# Altium project activity_tracker.PrjPCB
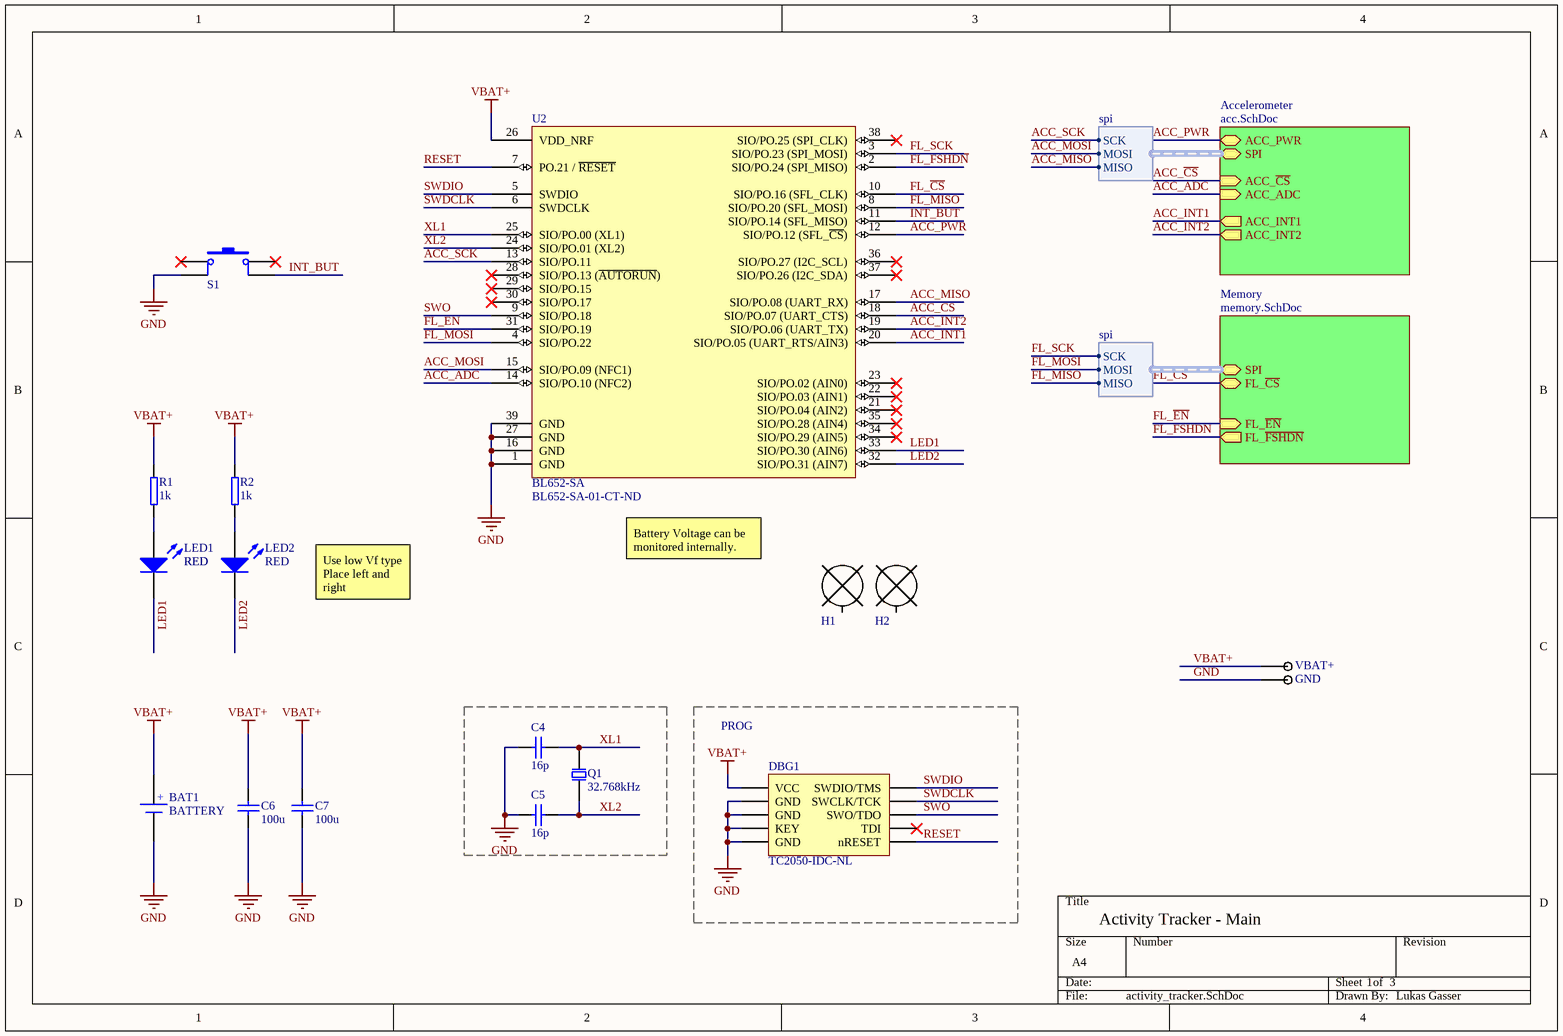
[diagram p0: activity_tracker.SchDoc]
ProjectRevision: 0.2.0
3 sheets, 28 parts. Net scope: hierarchical (ports join the sheet entries above them; power ports are global).
Board files: activity_tracker.PcbDoc, activity_tracker_panel.PcbDoc, activity_tracker_panel_support.PcbDoc
Sheets:
  activity_tracker.SchDoc
    Accelerometer = acc.SchDoc
    Memory = memory.SchDoc

## Sheet activity_tracker.SchDoc: Activity Tracker - Main
size A4; DrawnBy: Lukas Gasser; DocumentNumber: 1; Revision: 0.2.0; SheetNumber: 1; SheetTotal: 3

### Parts
BAT1  BATTERY  [BK-912_MIN_FP]
C4  16p  [CAPC1608X95N]
C5  16p  [CAPC1608X95N]
C6  100u  [CAPC3216X18N]
C7  100u  [CAPC3216X18N]
DBG1  TC2050-IDC-NL  [TC2050-IDC-NL]
GND  Testpoint  [POGO1]  (value not drawn)  (no BOM)
H1  HOLE  [M1_SMALL_NOKEEPOUT]  (value not drawn)  (no BOM)
H2  HOLE  [M1_SMALL_NOKEEPOUT]  (value not drawn)  (no BOM)
LED1  RED  [LED0603]
LED2  RED  [LED0603]
Q1  32.768kHz  [ABS06]
R1  1k  [RESC1608X55N]
R2  1k  [RESC1608X55N]
S1  SW-PB-4T  [TL3315NF250Q]  (value not drawn)
U2  BL652-SA  Supplier Part Number 1: BL652-SA-01-CT-ND  [BL652-SA_NO_KEEPOUT]
VBAT+  Testpoint  [POGO1]  (value not drawn)  (no BOM)

### Blocks framed on the sheet
PROG: DBG1

### Sub-sheets
Accelerometer = acc.SchDoc: SPI (harness spi), ACC_~{CS} (in), ACC_INT1 (out), ACC_INT2 (out), ACC_ADC (in), ACC_PWR
Memory = memory.SchDoc: SPI (harness spi), FL_~{CS}, FL_~{EN} (in), FL_~{FSHDN} (out)

### Harnesses
spi: MISO, SCK, MOSI

### Nets
GND: BAT1.- C4.1 C5.1 C6.1 C7.1 DBG1.3(GND) DBG1.5(GND) DBG1.7(KEY) DBG1.9(GND) GND.1 S1.2 U2.1(GND) U2.16(GND) U2.27(GND) U2.39(GND)
VBAT+: BAT1.+ C6.2 C7.2 DBG1.1(VCC) R1.2 R2.2 U2.26(VDD_NRF) VBAT+.1
ACC_ADC: U2.14(SIO/PO.10_(NFC2)) ; sheet Accelerometer/ACC_ADC
ACC_~{CS}: U2.18(SIO/PO.07_(UART_CTS)) ; sheet Accelerometer/ACC_~{CS}
ACC_INT1: U2.20(SIO/PO.05_(UART_RTS/AIN3)) ; sheet Accelerometer/ACC_INT1
ACC_INT2: U2.19(SIO/PO.06_(UART_TX)) ; sheet Accelerometer/ACC_INT2
ACC_MISO: U2.17(SIO/PO.08_(UART_RX)) ; sheet Accelerometer/SPI.MISO
ACC_MOSI: U2.15(SIO/PO.09_(NFC1)) ; sheet Accelerometer/SPI.MOSI
ACC_PWR: U2.12(SIO/PO.12_(SFL_~{CS})) ; sheet Accelerometer/ACC_PWR
ACC_SCK: U2.13(SIO/PO.11) ; sheet Accelerometer/SPI.SCK
FL_~{CS}: U2.10(SIO/PO.16_(SFL_CLK)) ; sheet Memory/FL_~{CS}
FL_~{EN}: U2.31(SIO/PO.19) ; sheet Memory/FL_~{EN}
FL_~{FSHDN}: U2.2(SIO/PO.24_(SPI_MISO)) ; sheet Memory/FL_~{FSHDN}
FL_MISO: U2.8(SIO/PO.20_(SFL_MOSI)) ; sheet Memory/SPI.MISO
FL_MOSI: U2.4(SIO/PO.22) ; sheet Memory/SPI.MOSI
FL_SCK: U2.3(SIO/PO.23_(SPI_MOSI)) ; sheet Memory/SPI.SCK
INT_BUT: S1.4 U2.11(SIO/PO.14_(SFL_MISO))
LED1: LED1.2(K) U2.33(SIO/PO.30_(AIN6))
LED2: LED2.2(K) U2.32(SIO/PO.31_(AIN7))
RESET: DBG1.10(nRESET) U2.7(PO.21_/_~{RESET})
SWDCLK: DBG1.4(SWCLK/TCK) U2.6(SWDCLK)
SWDIO: DBG1.2(SWDIO/TMS) U2.5(SWDIO)
SWO: DBG1.6(SWO/TDO) U2.9(SIO/PO.18)
XL1: C4.2 Q1.2 U2.25(SIO/PO.00_(XL1))
XL2: C5.2 Q1.1 U2.24(SIO/PO.01_(XL2))
NetLED1_1: LED1.1(A) R1.1
NetLED2_1: LED2.1(A) R2.1

Not connected (* = marked no-connect by the designer): DBG1 8(TDI)*; H1 H; H2 H; S1 1* 3*; U2 21(SIO/PO.04_(AIN2))* 22(SIO/PO.03_(AIN1))* 23(SIO/PO.02_(AIN0))* 28(SIO/PO.13_(~{AUTORUN}))* 29(SIO/PO.15)* 30(SIO/PO.17)* 34(SIO/PO.29_(AIN5))* 35(SIO/PO.28_(AIN4))* 36(SIO/PO.27_(I2C_SCL))* 37(SIO/PO.26_(I2C_SDA))* 38(SIO/PO.25_(SPI_CLK))*

### Notes on the sheet
- Battery Voltage can be monitored internally.
- Use low Vf type
  Place left and right

### Library data of the parts
C4 C5 = C: Capacitor; Voltage: 50V; Value: 16p; Supplier 1: Digi-Key; Supplier Part Number 1: 1276-2204-1-ND; ClassName: ignoreSilkscreen
C6 C7 = C: Capacitor; Voltage: 6V3; Value: 100u; Supplier 1: Digi-Key; Supplier Part Number 1: 490-10525-1-ND
DBG1 = TC2050-IDC-NL: ARM Mini JTAG / SWD 10-pin connector; Supplier 1: Digi-Key; Supplier Part Number 1: TC2050-IDC-NL-ND
LED1 LED2 = LED: Color: RED; Supplier 1: Digi-Key; Supplier Part Number 1: 754-1541-1-ND
Q1 = Q-0Shield: Crystal; Frequency: 32.768kHz; PartNumber: *; ClassName: directConnect,ignoreSilkscreen; Supplier 1: Digi-Key; Supplier Part Number 1: 535-10247-1-ND
R1 R2 = R: Resistor; Value: 1k; Supplier 1: Digi-Key; Supplier Part Number 1: 1276-5062-1-ND
S1 = SW-PB-4T: Tact switch; ClassName: directConnect; Supplier 1: Digi-Key; Supplier Part Number 1: EG4622CT-ND
U2 = BL652-SA: RF TXRX MOD BLUETOOTH INT ANT; Supplier 1: Digi-Key
BAT1 = BATTERY: ClassName: directConnect; Supplier 1: Digi-Key; Supplier Part Number 1: BK-912-G-CT-ND
GND VBAT+ = Testpoint: ClassName: directConnect
H1 H2 = HOLE: ClassName: directConnect

## Sheet acc.SchDoc: Activity Tracker - Accelerometer
size A4; DrawnBy: Lukas Gasser; DocumentNumber: 3; Revision: 0.2.0; SheetNumber: 3; SheetTotal: 3
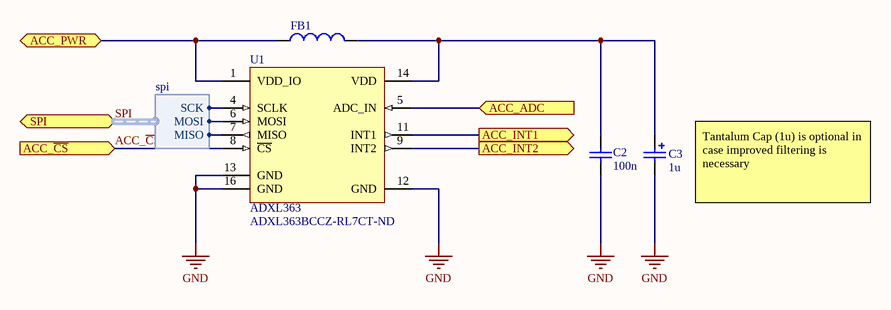
[diagram p1: acc.SchDoc]

### Parts
C2  100n  [CAPC1608X95N]
C3  1u  [CAPC1608X95N_POL]
FB1  (no value)  [RESC1608X55N]
U1  ADXL363  Supplier Part Number 1: ADXL363BCCZ-RL7CT-ND  [LGA_ADXL363]

### Ports
ACC_ADC (in), ACC_INT1 (out), ACC_INT2 (out), ACC_PWR, ACC_~{CS} (in), SPI (harness spi)

### Harnesses
spi: MISO, SCK, MOSI

### Nets
GND: C2.1 C3.2 U1.12(GND) U1.13(GND) U1.16(GND)
ACC_ADC: U1.5(ADC_IN) ; port ACC_ADC
ACC_~{CS}: U1.8(~{CS}) ; port ACC_~{CS}
ACC_INT1: U1.11(INT1) ; port ACC_INT1
ACC_INT2: U1.9(INT2) ; port ACC_INT2
ACC_MISO: U1.7(MISO) ; port SPI.MISO
ACC_MOSI: U1.6(MOSI) ; port SPI.MOSI
ACC_PWR: FB1.1 U1.1(VDD_IO) ; port ACC_PWR
ACC_SCK: U1.4(SCLK) ; port SPI.SCK
NetC2_2: C2.2 C3.1 FB1.2 U1.14(VDD)

Not connected (* = marked no-connect by the designer): U1 2(NC) 3(RES) 10(RES) 15(NC)

### Buses and harness runs
harness SPI = port SPI

### Notes on the sheet
- (near C3) Tantalum Cap (1u) is optional in case improved filtering is necessary

### Library data of the parts
C2 = C: Capacitor; Voltage: 16V; Value: 100n; Supplier 1: Digi-Key; Supplier Part Number 1: 311-1088-1-ND
C3 = CPOL: Polarized Capacitor (Surface Mount); Voltage: 16V; Value: 1u; Supplier 1: Digi-Key; Supplier Part Number 1: 478-8658-1-ND
FB1 = FB: Ferrite Bead; Supplier 1: Digi-Key; Supplier Part Number 1: 587-1895-1-ND
U1 = ADXL363: Micropower 3-Sensor Combination  Including Acceleration and Temperature; Supplier 1: Digi-Key

## Sheet memory.SchDoc: Activity Tracker - Memory
size A4; DrawnBy: Lukas Gasser; DocumentNumber: 2; Revision: 0.2.0; SheetNumber: 2; SheetTotal: 3
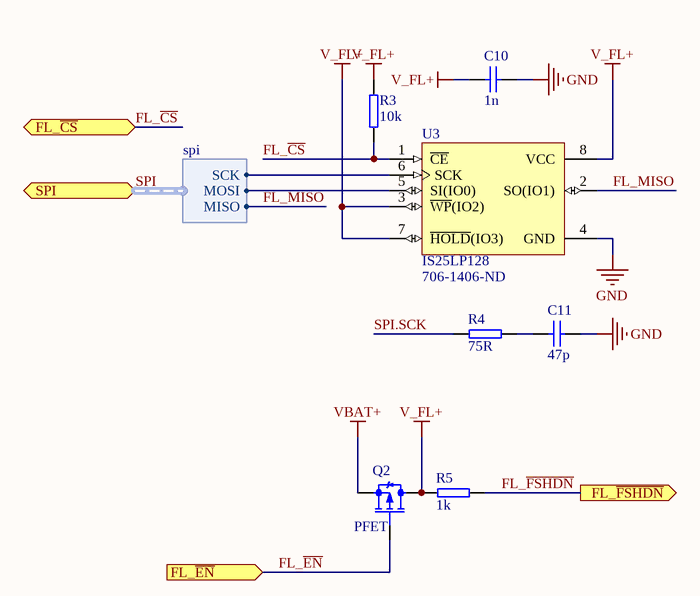
[diagram p2: memory.SchDoc]

### Parts
C10  1n  [CAPC1608X95N]
C11  47p  [CAPC1608X95N]
Q2  PFET  [SOT95P237X112-3N]
R3  10k  [RESC1608X55N]
R4  75R  [RESC1608X55N]
R5  1k  [RESC1608X55N]
U3  IS25LP128  Supplier Part Number 1: 706-1406-ND  [QFN127P500X600X80-8M_MIN_EP]

### Ports
FL_~{CS}, FL_~{EN} (in), FL_~{FSHDN} (out), SPI (harness spi)

### Harnesses
spi: MISO, SCK, MOSI

### Nets
GND: C10.1 C11.2 U3.4(GND)
V_FL+: C10.2 Q2.3(D) R3.2 R5.1 U3.3(~{WP}(IO2)) U3.7(~{HOLD}(IO3)) U3.8(VCC)
VBAT+: Q2.2(S)
FL_~{CS}: R3.1 U3.1(~{CE}) ; port FL_~{CS}
FL_~{EN}: Q2.1(G) ; port FL_~{EN}
FL_~{FSHDN}: R5.2 ; port FL_~{FSHDN}
FL_MISO: U3.2(SO(IO1)) ; port SPI.MISO
FL_MOSI: U3.5(SI(IO0)) ; port SPI.MOSI
FL_SCK: U3.6(SCK) ; port SPI.SCK
SPI.SCK: R4.1
NetC11_1: C11.1 R4.2

### Buses and harness runs
harness SPI = port SPI

### Library data of the parts
C10 C11 = C: Capacitor; Voltage: 50V; Supplier 1: Digi-Key
  C10: Value: 1n; Supplier Part Number 1: 478-1215-1-ND
  C11: Value: 47p; Supplier Part Number 1: 1276-1037-1-ND
Q2 = IRLML2246TRPBF: P-Channel MOSFET, 20V 2.6A; ClassName: directConnect; Supplier 1: Digi-Key; Supplier Part Number 1: IRLML2246TRPBFCT-ND
R3-R5 = R: Resistor; Supplier 1: Digi-Key
  R3: Value: 10k; Supplier Part Number 1: 311-10KGRCT-ND
  R4: Value: 75R; Supplier Part Number 1: RHM75.0CFCT-ND
  R5: Value: 1k; Supplier Part Number 1: 1276-5062-1-ND
U3 = IS25LP128: 3V SERIAL FLASH MEMORY WITH 133MHZ MULTI  I/O   SPI & QUAD I/O QPI DTR INTERFACE; ClassName: directConnect; Supplier 1: Digi-Key

## Nets that join several sheets
GND: activity_tracker (15 pins), acc (5 pins), memory (C10.1 C11.2 U3.4)
VBAT+: activity_tracker (8 pins), memory (Q2.2)
ACC_ADC: activity_tracker (U2.14), acc (U1.5)
ACC_~{CS}: activity_tracker (U2.18), acc (U1.8)
ACC_INT1: activity_tracker (U2.20), acc (U1.11)
ACC_INT2: activity_tracker (U2.19), acc (U1.9)
ACC_MISO: activity_tracker (U2.17), acc (U1.7)
ACC_MOSI: activity_tracker (U2.15), acc (U1.6)
ACC_PWR: activity_tracker (U2.12), acc (FB1.1 U1.1)
ACC_SCK: activity_tracker (U2.13), acc (U1.4)
FL_~{CS}: activity_tracker (U2.10), memory (R3.1 U3.1)
FL_~{EN}: activity_tracker (U2.31), memory (Q2.1)
FL_~{FSHDN}: activity_tracker (U2.2), memory (R5.2)
FL_MISO: activity_tracker (U2.8), memory (U3.2)
FL_MOSI: activity_tracker (U2.4), memory (U3.5)
FL_SCK: activity_tracker (U2.3), memory (U3.6)

## Assembly variants
initial: not fitted C3 C11 R2 R3